# EAGLE design multifilament (EAGLE 7.5.0)
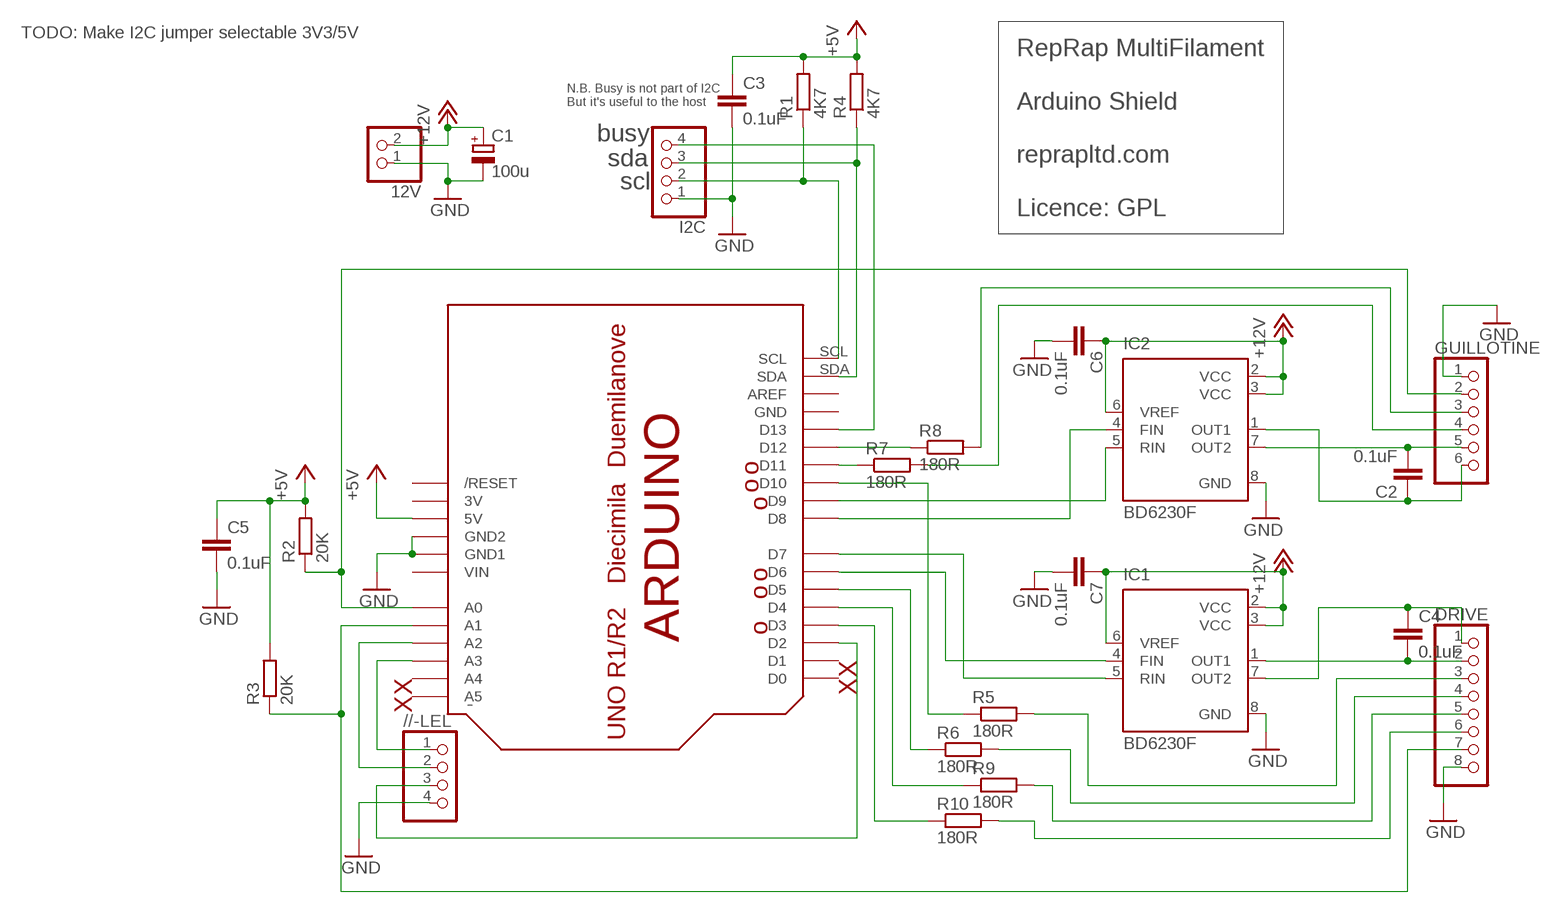
[diagram p0: schematic, sheet 1]

## Parts
12V  PINHD-1X2  [1X02]
//-LEL  PINHD-1X4  [1X04]
C1  100u  CPOL-EUSANYO_9F  [SANYO-OSCON_9F]
C2  0.1uF  C-EUC0805  [C0805]
C3  0.1uF  C-EUC0805  [C0805]
C4  0.1uF  C-EUC0805  [C0805]
C5  0.1uF  C-EUC0805  [C0805]
C6  0.1uF  C-EUC0805  [C0805]
C7  0.1uF  C-EUC0805  [C0805]
DRIVE  PINHD-1X8  [1X08]
GUILLOTINE  PINHD-1X6  [1X06]
I2C  PINHD-1X4  [1X04]
IC1  BD6230F  [SOP8]
IC2  BD6230F  [SOP8]
R1  4K7  R-EU_M0805  [M0805]
R2  20K  R-EU_M0805  [M0805]
R3  20K  R-EU_M0805  [M0805]
R4  4K7  R-EU_M0805  [M0805]
R5  180R  R-EU_M0805  [M0805]
R6  180R  R-EU_M0805  [M0805]
R7  180R  R-EU_M0805  [M0805]
R8  180R  R-EU_M0805  [M0805]
R9  180R  R-EU_M0805  [M0805]
R10  180R  R-EU_M0805  [M0805]
U$1  ARDUINO-BPLACE  [ARDUINO-BPLACE]

## Nets
+5V: C3.1 C5.1 R1.2 R2.2 R3.2 R4.2 U$1.5V
+12V: 12V.2 C1.+ C6.1 C7.1 IC1.2(VCC) IC1.3(VCC) IC1.6(VREF) IC2.2(VCC) IC2.3(VCC) IC2.6(VREF)
GND: 12V.1 //-LEL.4 C1.- C3.2 C5.2 C6.2 C7.2 DRIVE.8 GUILLOTINE.1 I2C.1 IC1.8(GND) IC2.8(GND) U$1.GND1 U$1.GND2
N$1: I2C.2 R1.1 U$1.SCL
N$2: GUILLOTINE.2 R2.1 U$1.A0
N$3: C2.2 GUILLOTINE.5 IC2.7(OUT2)
N$5: C4.2 DRIVE.2 IC1.1(OUT1)
N$7: R6.1 U$1.D5
N$8: IC1.4(FIN) U$1.D6
N$9: IC1.5(RIN) U$1.D7
N$10: IC2.4(FIN) U$1.D8
N$11: I2C.3 R4.1 U$1.SDA
N$12: DRIVE.7 R3.1 U$1.A1
N$13: IC2.5(RIN) U$1.D9
N$14: I2C.4 U$1.D13
N$15: GUILLOTINE.3 R8.2
N$16: R7.1 U$1.D11
N$17: GUILLOTINE.4 R7.2
N$18: R8.1 U$1.D12
N$19: R5.1 U$1.D10
N$20: DRIVE.3 R5.2
N$21: DRIVE.4 R6.2
N$22: R9.1 U$1.D4
N$23: DRIVE.5 R9.2
N$24: R10.1 U$1.D3
N$25: DRIVE.6 R10.2
N$26: //-LEL.2 U$1.A2
N$27: //-LEL.1 U$1.A3
N$28: //-LEL.3 U$1.D2
N$30: C4.1 DRIVE.1 IC1.7(OUT2)
N$31: C2.1 GUILLOTINE.6 IC2.1(OUT1)
Unconnected: U$1.A4 U$1.A5 U$1.AREF U$1.D0 U$1.D1 U$1.RESET(/RESET)

## Notes on the sheet
- TODO: Make I2C jumper selectable 3V3/5V
- N.B. Busy is not part of I2C
  But it's useful to the host
- busy
- sda
- scl
- RepRap MultiFilament
  
  Arduino Shield
  
  reprapltd.com
  
  Licence: GPL
- o
- o
- o
- o
- o
- o
- X
- X | X
- X

## Power pins joined to a net without a drawn wire
3V: U$1.3V
GND: U$1.GND
VIN: U$1.VIN

## Library data of the parts
12V = pinhead:PINHD-1X2: PIN HEADER
//-LEL I2C = pinhead:PINHD-1X4: PIN HEADER
C1 = rcl:CPOL-EU: POLARIZED CAPACITOR, European symbol
C2-C7 = rcl:C-EU: CAPACITOR, European symbol
DRIVE = pinhead:PINHD-1X8: PIN HEADER
GUILLOTINE = pinhead:PINHD-1X6: PIN HEADER
IC1 IC2 = rohm:BD623*F: H-bridge driver for brush motors Source: http://www.rohm.com/products/databook/motor/pdf/bd623x_series-e.pdf; MPN: BD6230F-E2; OC_FARNELL: 1716264; OC_NEWARK: 15R0529
R1-R10 = rcl:R-EU_: RESISTOR, European symbol
U$1 = adafruit:ARDUINO: Arduino Diecimila/Duemilanove Make a shield with ease, this package has all the named pins as well as the two mounting drill holes and an outline of the USB and DC power connector. The outline is on the DIMENSION layer, so if your board house uses it they will cut the outline to match. http://www.ladyada.net/library/pcb/eaglelibrary.html

## Board
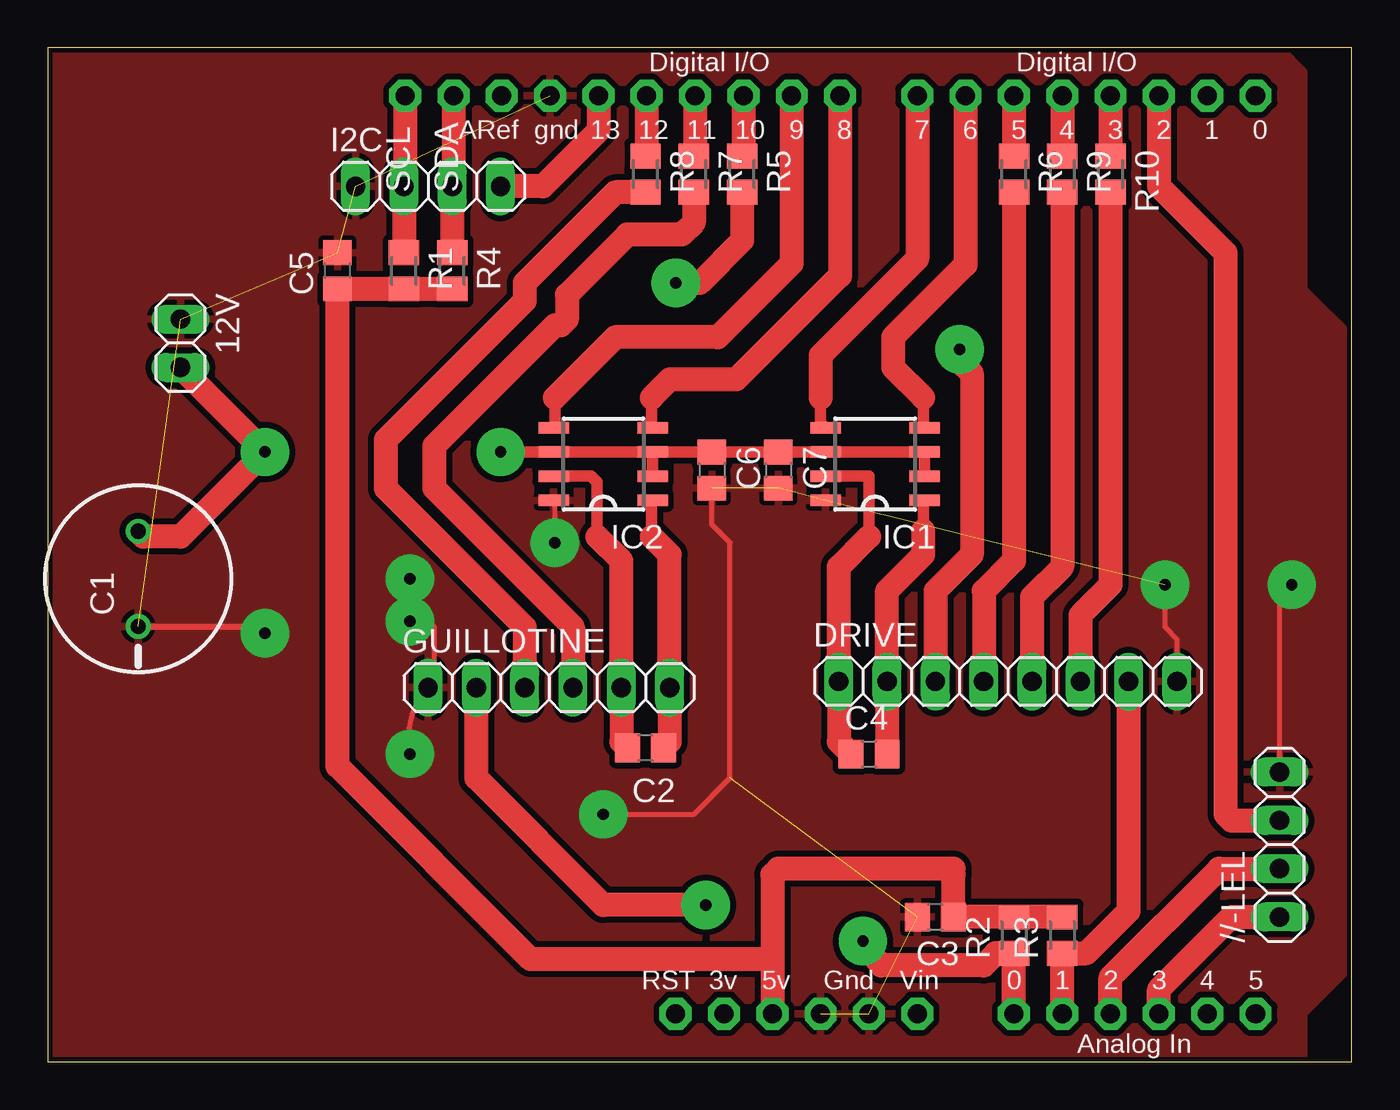
[diagram p1: board, top side]
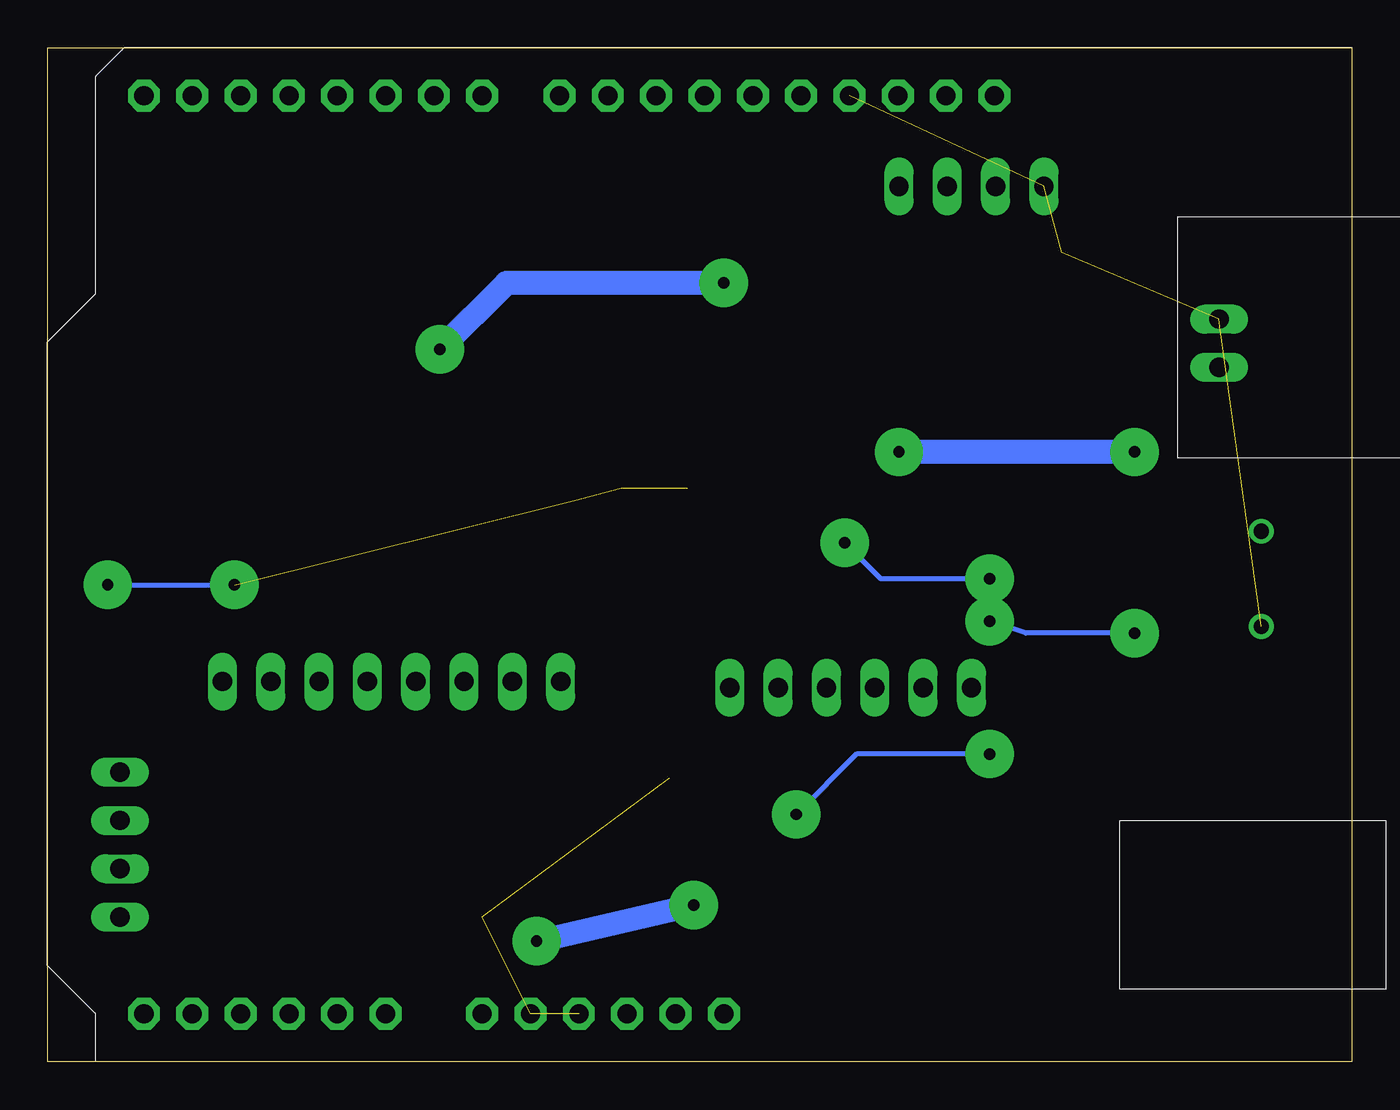
[diagram p2: board, bottom side, seen from below]

Size 68.57 x 53.33 mm. Coordinates in mm from the lower left corner, seen from the top.
Outline: 0,0 68.57,0 68.57,53.33 0,53.33 0,0
Copper layers (1*16): Top 0.035mm / dielectric 1.5mm / Bottom 0.035mm
Design rules "pcbtrain *": minimum track width 0.2mm, minimum drill 0.4mm, track to track 0.31mm, track to pad 0.31mm, pad to pad 0.31mm, via to via 0.31mm, smd to smd 0mil, copper to edge 10mil, drill to drill 0.31mm, minimum pad ring 10mil, minimum via ring 10mil, stop-mask expansion 0.125mm, vias tented up to drill 0mil, thermal gap 10mil

### Footprints (pad centres in the part's own frame; a part is rotated, then mirrored left to right if it is on the bottom)
1X02 = drill 1.016 long: 1 -1.27,0; 2 1.27,0
1X04 = drill 1.016 long: 1 -3.81,0; 2 -1.27,0; 3 1.27,0; 4 3.81,0
SANYO-OSCON_9F = drill 0.8 pad 1.27: + 2.5,0; - -2.5,0
C0805 = smd 1.3 x 1.5: 1 -0.95,0; 2 0.95,0
1X08 = drill 1.016 long: 1 -8.89,0; 2 -6.35,0; 3 -3.81,0; 4 -1.27,0; 5 1.27,0; 6 3.81,0; 7 6.35,0; 8 8.89,0
1X06 = drill 1.016 long: 1 -6.35,0; 2 -3.81,0; 3 -1.27,0; 4 1.27,0; 5 3.81,0; 6 6.35,0
SOP8 = smd 0.6 x 1.6: 1 -1.905,-2.6; 2 -0.635,-2.6; 3 0.635,-2.6; 4 1.905,-2.6; 5 1.905,2.6; 6 0.635,2.6; 7 -0.635,2.6; 8 -1.905,2.6
M0805 = smd 1.3 x 1.6: 1 -0.95,0; 2 0.95,0
ARDUINO-BPLACE = drill 1 pad 1.676 octagon: 3V 35.56,2.54; 5V 38.1,2.54; A0 50.8,2.54; A1 53.34,2.54; A2 55.88,2.54; A3 58.42,2.54; A4 60.96,2.54; A5 63.5,2.54; AREF 23.876,50.8; D0 63.5,50.8; D1 60.96,50.8; D2 58.42,50.8; D3 55.88,50.8; D4 53.34,50.8; D5 50.8,50.8; D6 48.26,50.8; D7 45.72,50.8; D8 41.656,50.8; D9 39.116,50.8; D10 36.576,50.8; D11 34.036,50.8; D12 31.496,50.8; D13 28.956,50.8; GND 26.416,50.8; GND1 43.18,2.54; GND2 40.64,2.54; RESET 33.02,2.54; SCL 18.796,50.8; SDA 21.336,50.8; VIN 45.72,2.54

### Placement (x,y rotation side)
12V  6.99,37.78 270 top
//-LEL  64.77,11.43 90 top
C1  4.76,25.4 90 top
C2  31.43,16.51 180 top
C3  46.67,7.62 180 top
C4  43.18,16.19 0 top
C5  15.24,41.59 90 top
C6  34.92,31.11 270 top
C7  38.42,31.11 270 top
DRIVE  50.48,20 0 top
GUILLOTINE  26.35,19.68 0 top
I2C  20,46.04 0 top
IC1  43.5,31.43 90 top
IC2  29.21,31.43 90 top
R1  18.73,41.59 270 top
R2  50.8,6.67 90 top
R3  53.34,6.67 90 top
R4  21.27,41.59 270 top
R5  36.51,46.67 270 top
R6  50.8,46.67 270 top
R7  33.97,46.67 270 top
R8  31.43,46.67 270 top
R9  53.34,46.67 270 top
R10  55.88,46.67 270 top
U$1  0,0 0 top

### Tracks (layer width: path | path; a pad name or v marks a point on that pad's centre or on a via)
+5V
  Top 1.27: R3.2 R2.2 C3.1 47.62,9.84 47.62,10.16 38.42,10.16 38.1,9.84 38.1,5.4 | 38.1,5.4 U$1.5V | R4.2 R1.2 C5.1 15.24,15.56 25.4,5.4 38.1,5.4
+12V  (via drill 0.6 pad 2.54)
  Top 0.61: IC2.3 IC2.6 24.45,32.07 | IC2.3 35.24,32.07 C6.1 C7.1 IC1.6 IC1.3 IC1.2 | IC2.3 IC2.2
  Top 1.27: v23.81,32.07 24.45,32.07 | v11.43,32.07 6.99,27.62 5.04,27.62 C1.+ | 12V.2 v11.43,32.07 | 11.75,31.75 v11.43,32.07
  Bottom 1.27: v11.43,32.07 v23.81,32.07
GND  (via drill 0.6 pad 2.54)  (10 unrouted)
  Top 0.254: 11.41,22.52 v11.43,22.54 | v19.05,25.4 arc-71 v19.05,23.18 20,23.18 20.32,22.86 20.32,20 GUILLOTINE.1 arc55 v19.05,16.19 | v26.67,27.3 26.67,29.47 IC2.8 | v29.21,13.02 33.97,13.02 35.88,14.92 35.88,27.3 34.92,28.26 C6.2 | //-LEL.4 64.77,24.45 v65.41,25.08 | v58.74,25.08 58.74,22.86 59.37,22.23 DRIVE.8
  Top 0.305: C1.- 11.07,22.9 v11.43,22.54
  Bottom 0.254: v11.43,22.54 17.14,22.54 v19.05,23.18 | v19.05,25.4 24.77,25.4 v26.67,27.3 | v19.05,16.19 26.04,16.19 v29.21,13.02 | v65.41,25.08 v58.74,25.08
  pour Top: 0,0 0,53.34 64.77,53.34 66.04,52.07 66.04,40.64 68.58,38.1 68.58,5.08 66.04,2.54 66.04,0
N$1
  Top 1.27: U$1.SCL 18.8,46.1 I2C.2 R1.1
N$2  (via drill 0.6 pad 2.54)
  Top 1.27: U$1.A0 R2.1 49.85,5.72 49.21,5.08 43.81,5.08 v42.86,6.35 | v34.61,8.26 29.21,8.26 22.54,14.92 GUILLOTINE.2
  Bottom 1.27: v42.86,6.35 v34.61,8.26
N$3
  Top 0.61: 28.89,27.62 28.89,30.48 28.57,30.8 IC2.7
  Top 1.27: C2.2 30.16,16.83 GUILLOTINE.5 30.16,26.35 28.89,27.62
N$5
  Top 0.61: 46.04,27.94 46.04,29.47 IC1.1
  Top 1.27: C4.2 DRIVE.2 44.13,24.77 46.04,26.67 46.04,27.94
N$7
  Top 1.27: U$1.D5 R6.1
N$8
  Top 0.61: 46.04,34.92 46.04,33.4 IC1.4
  Top 1.27: U$1.D6 48.26,41.91 44.45,38.1 44.45,36.51 46.04,34.92
N$9
  Top 0.61: 40.64,34.92 40.64,33.59 IC1.5
  Top 1.27: U$1.D7 45.72,42.23 40.64,37.15 40.64,34.92
N$10
  Top 0.61: 31.75,34.92 31.75,33.4 IC2.4
  Top 1.27: U$1.D8 41.66,41.34 36.2,35.88 32.7,35.88 31.75,34.92
N$11
  Top 1.27: U$1.SDA 21.34,46.1 I2C.3 R4.1
N$12
  Top 1.27: U$1.A1 R3.1 54.61,5.71 56.83,7.94 DRIVE.7
N$13
  Top 0.61: 26.67,34.92 26.67,33.4 IC2.5
  Top 1.27: U$1.D9 39.12,41.97 35.24,38.1 29.84,38.1 26.67,34.92
N$14
  Top 1.27: U$1.D13 28.96,48.96 26.04,46.04 I2C.4
N$15
  Top 1.27: R8.2 29.85,45.72 25.08,40.96 25.08,40.01 17.78,32.7 17.78,30.16 25.08,22.86 GUILLOTINE.3
N$16
  Top 1.27: U$1.D11 34.04,47.69 R7.1
N$17
  Top 1.27: R7.2 33.97,44.13 33.34,43.5 30.48,43.5 27.3,40.32 27.3,39.05 26.99,38.73 26.67,38.73 20.32,32.38 20.32,30.16 27.62,22.86 GUILLOTINE.4
N$18
  Top 1.27: U$1.D12 31.5,47.69 R8.1
N$19
  Top 1.27: U$1.D10 36.58,47.69 R5.1
N$20  (via drill 0.6 pad 2.54)
  Top 1.27: R5.2 36.51,43.18 34.29,40.96 v33.02,40.96 | v47.94,37.47 47.94,36.83 48.58,36.2 48.58,26.67 46.67,24.77 DRIVE.3
  Bottom 1.27: v33.02,40.96 44.45,40.96 v47.94,37.47
N$21
  Top 1.27: R6.2 50.8,26.35 49.21,24.77 DRIVE.4
N$22
  Top 1.27: U$1.D4 R9.1
N$23
  Top 1.27: R9.2 53.34,26.04 51.75,24.45 DRIVE.5
N$24
  Top 1.27: U$1.D3 R10.1
N$25
  Top 1.27: R10.2 55.88,25.08 54.29,23.5 DRIVE.6 54.29,19.37
N$26
  Top 1.27: U$1.A2 55.88,4.45 61.59,10.16 //-LEL.2
N$27
  Top 1.27: U$1.A3 58.42,3.81 62.23,7.62 //-LEL.1
N$28
  Top 1.27: U$1.D2 58.42,46.04 61.91,42.55 61.91,13.02 62.23,12.7 //-LEL.3
N$30
  Top 0.61: 43.18,27.62 43.18,30.8 IC1.7
  Top 1.27: C4.1 41.59,16.83 DRIVE.1 41.59,26.04 43.18,27.62
N$31
  Top 0.61: 31.75,27.62 31.75,29.47 IC2.1
  Top 1.27: C2.1 32.7,16.83 GUILLOTINE.6 32.7,26.67 31.75,27.62